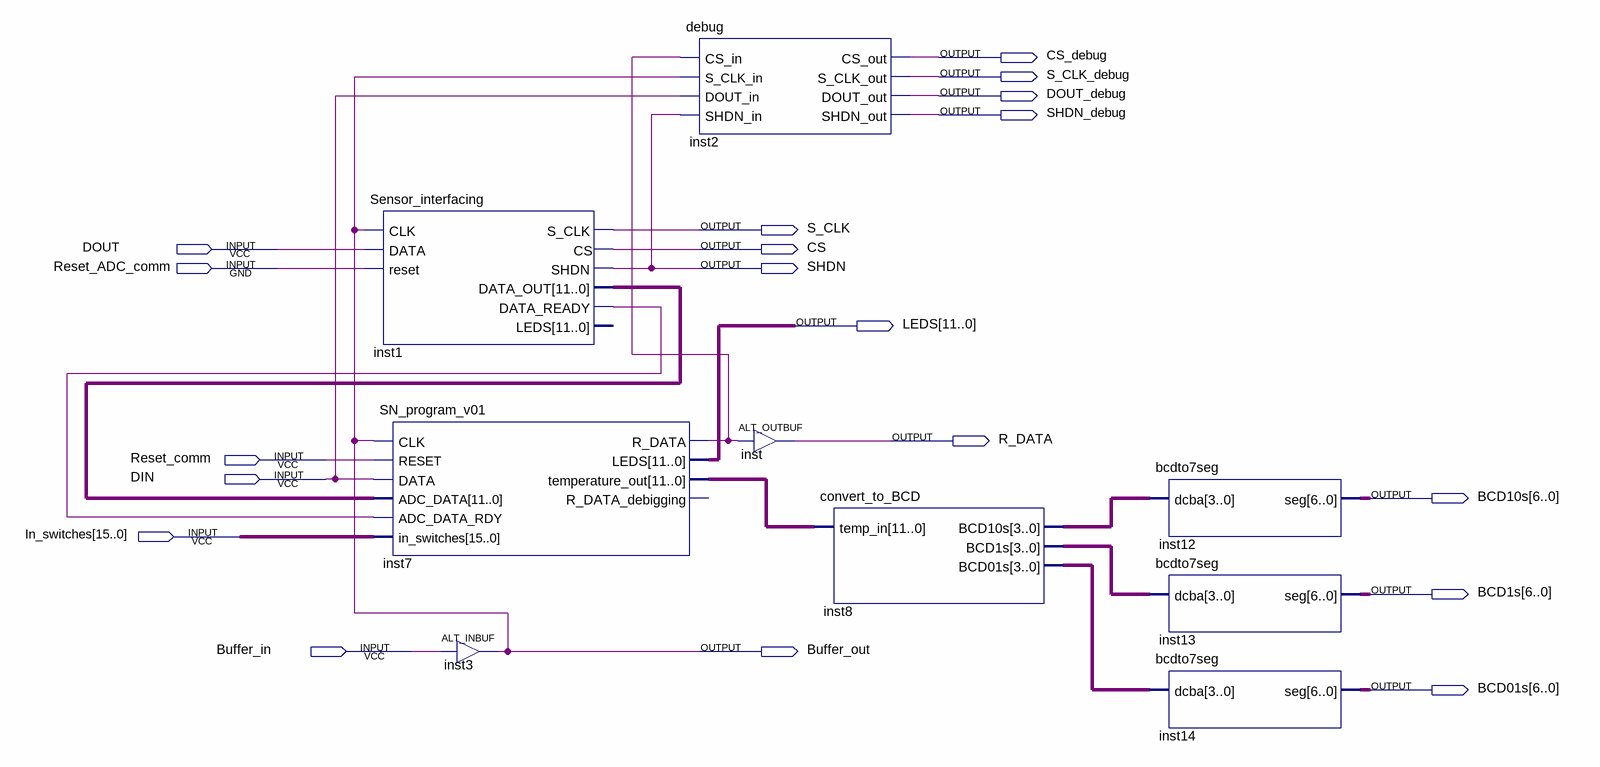
[diagram p0: schematic sheet]
// Quartus schematic SN_PROGRAM_V02.bdf as structural Verilog: 9 symbols, 19 pins
module SN_PROGRAM_V02 (
  input  DOUT,
  input  Reset_ADC_comm,
  input  Reset_comm,
  input  DIN,
  input  [15:0] In_switches,
  input  Buffer_in,
  output CS_debug,
  output S_CLK_debug,
  output DOUT_debug,
  output SHDN_debug,
  output S_CLK,
  output CS,
  output SHDN,
  output [11:0] LEDS,
  output R_DATA,
  output [6:0] BCD10s,
  output [6:0] BCD1s,
  output Buffer_out,
  output [6:0] BCD01s
);

  wire inst1_data_ready, inst7_r_data;
  wire [3:0] inst8_bcd1s, inst8_bcd01s, inst8_bcd10s;
  wire [11:0] inst1_data_out, inst7_temperature_out;

  Sensor_interfacing inst1 (
    .CLK(Buffer_out), .DATA(DOUT), .reset(Reset_ADC_comm), .S_CLK(S_CLK), .CS(CS), .SHDN(SHDN),
    .DATA_OUT(inst1_data_out), .DATA_READY(inst1_data_ready));  // open: LEDS
  SN_program_v01 inst7 (
    .CLK(Buffer_out), .RESET(Reset_comm), .DATA(DIN), .ADC_DATA(inst1_data_out),
    .ADC_DATA_RDY(inst1_data_ready), .in_switches(In_switches), .R_DATA(inst7_r_data), .LEDS(LEDS),
    .temperature_out(inst7_temperature_out));  // open: R_DATA_debigging
  ALT_INBUF inst3 (.i(Buffer_in), .o(Buffer_out));
  debug inst2 (
    .CS_in(inst7_r_data), .S_CLK_in(Buffer_out), .DOUT_in(DIN), .SHDN_in(SHDN), .CS_out(CS_debug),
    .S_CLK_out(S_CLK_debug), .DOUT_out(DOUT_debug), .SHDN_out(SHDN_debug));
  ALT_OUTBUF inst (.i(inst7_r_data), .o(R_DATA));
  convert_to_BCD inst8 (
    .temp_in(inst7_temperature_out), .BCD10s(inst8_bcd10s), .BCD1s(inst8_bcd1s), .BCD01s(inst8_bcd01s));
  bcdto7seg inst12 (.dcba(inst8_bcd10s), .seg(BCD10s));
  bcdto7seg inst13 (.dcba(inst8_bcd1s), .seg(BCD1s));
  bcdto7seg inst14 (.dcba(inst8_bcd01s), .seg(BCD01s));
endmodule
